# Altium schematic sheet pwr.SchDoc
size A3; SheetNumber: 4; SheetTotal: 6
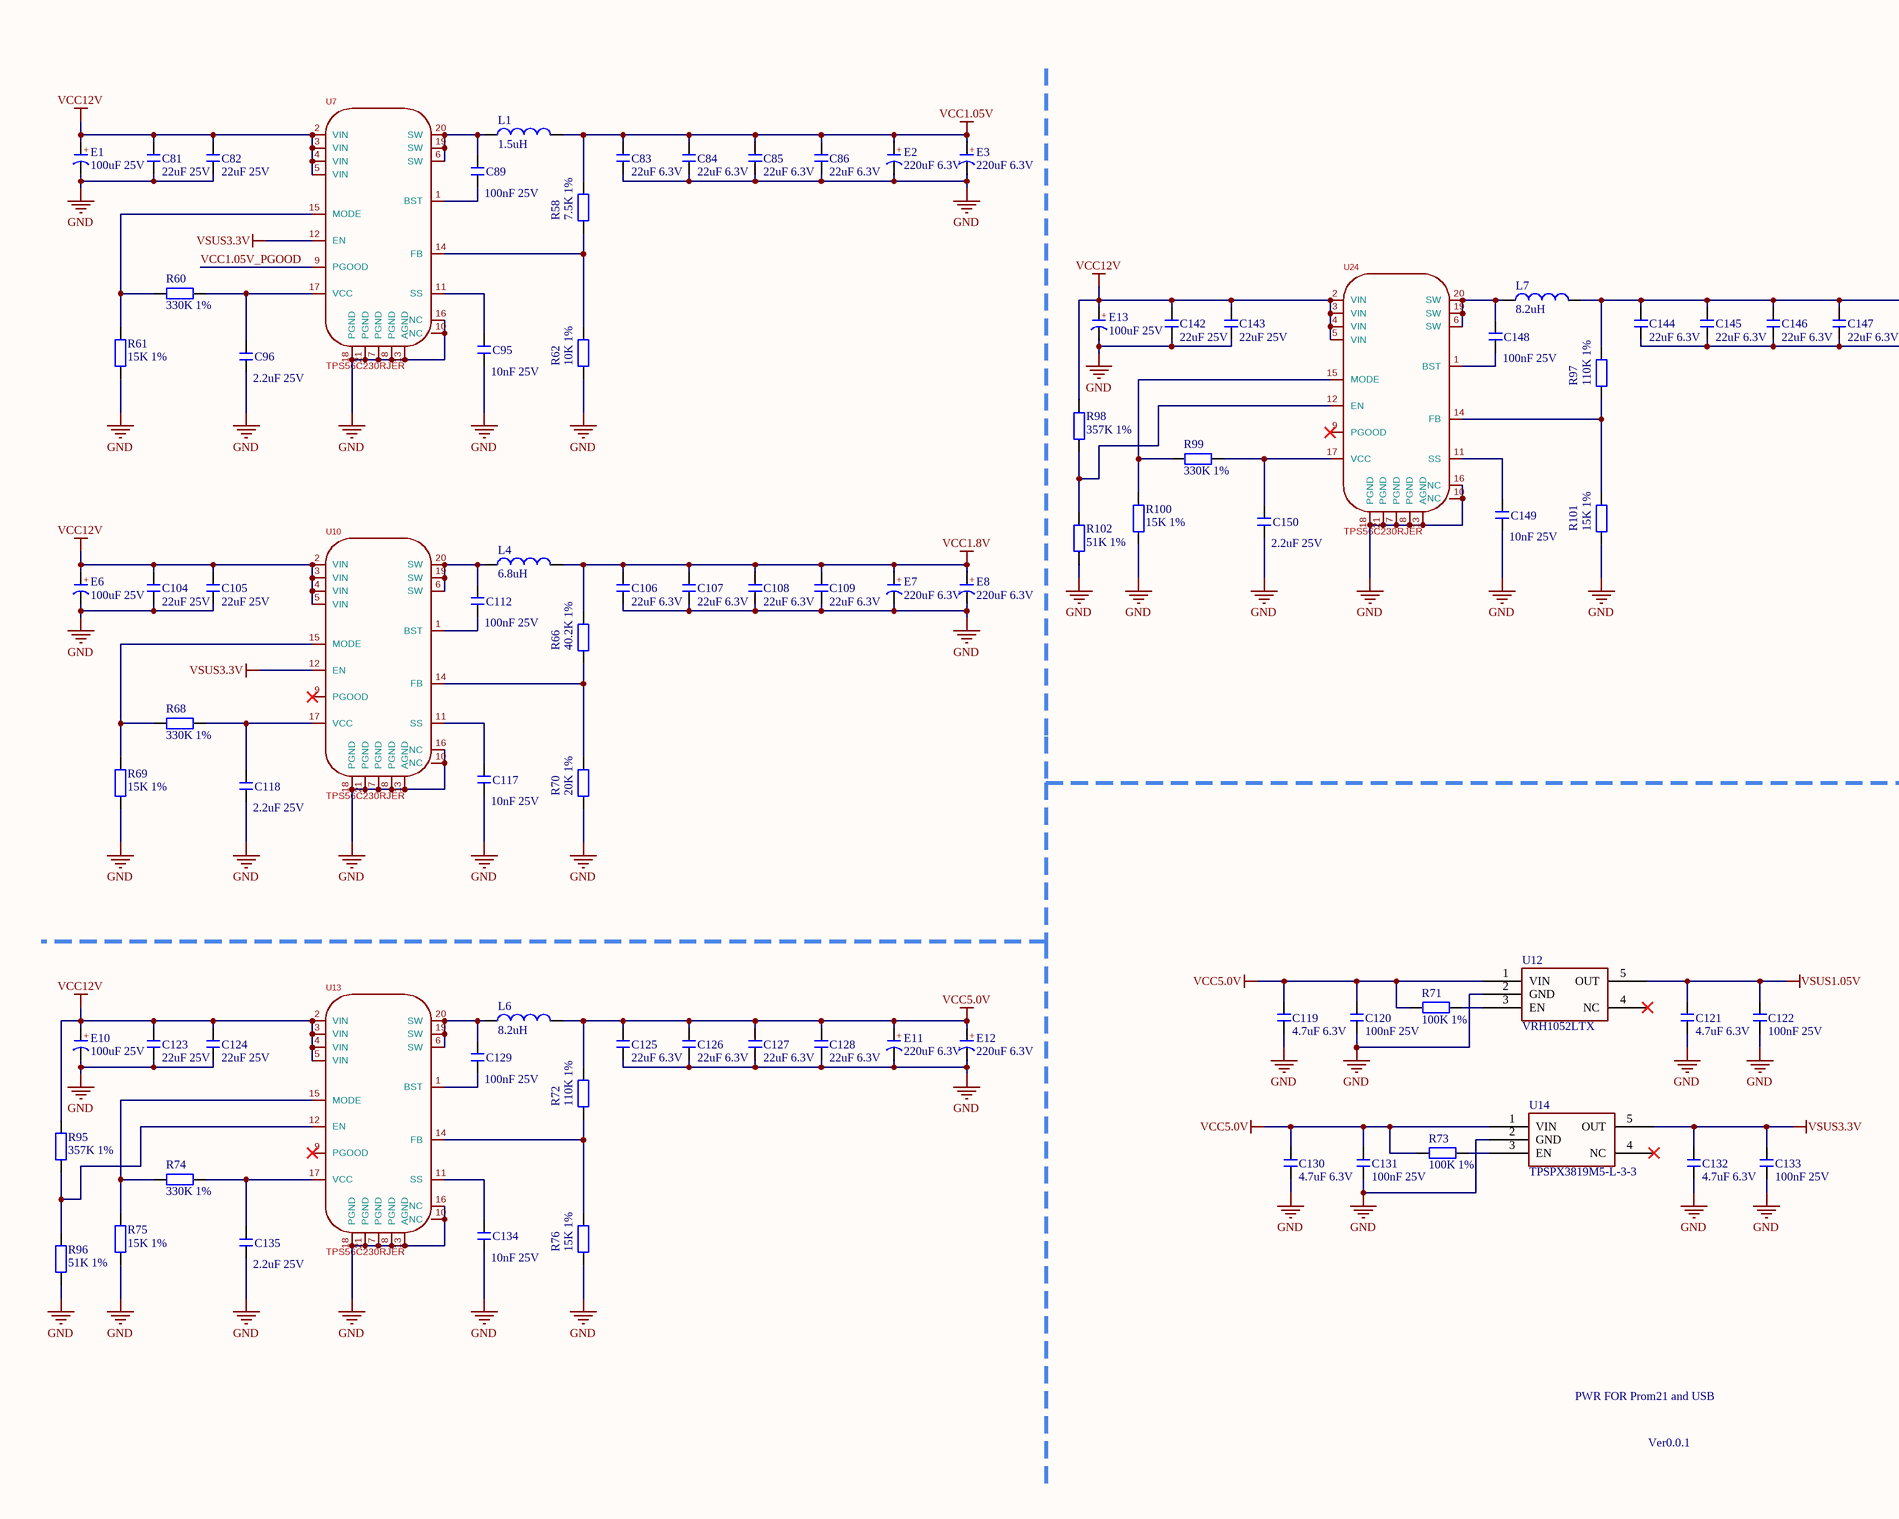
[diagram p0: pwr.SchDoc, left]
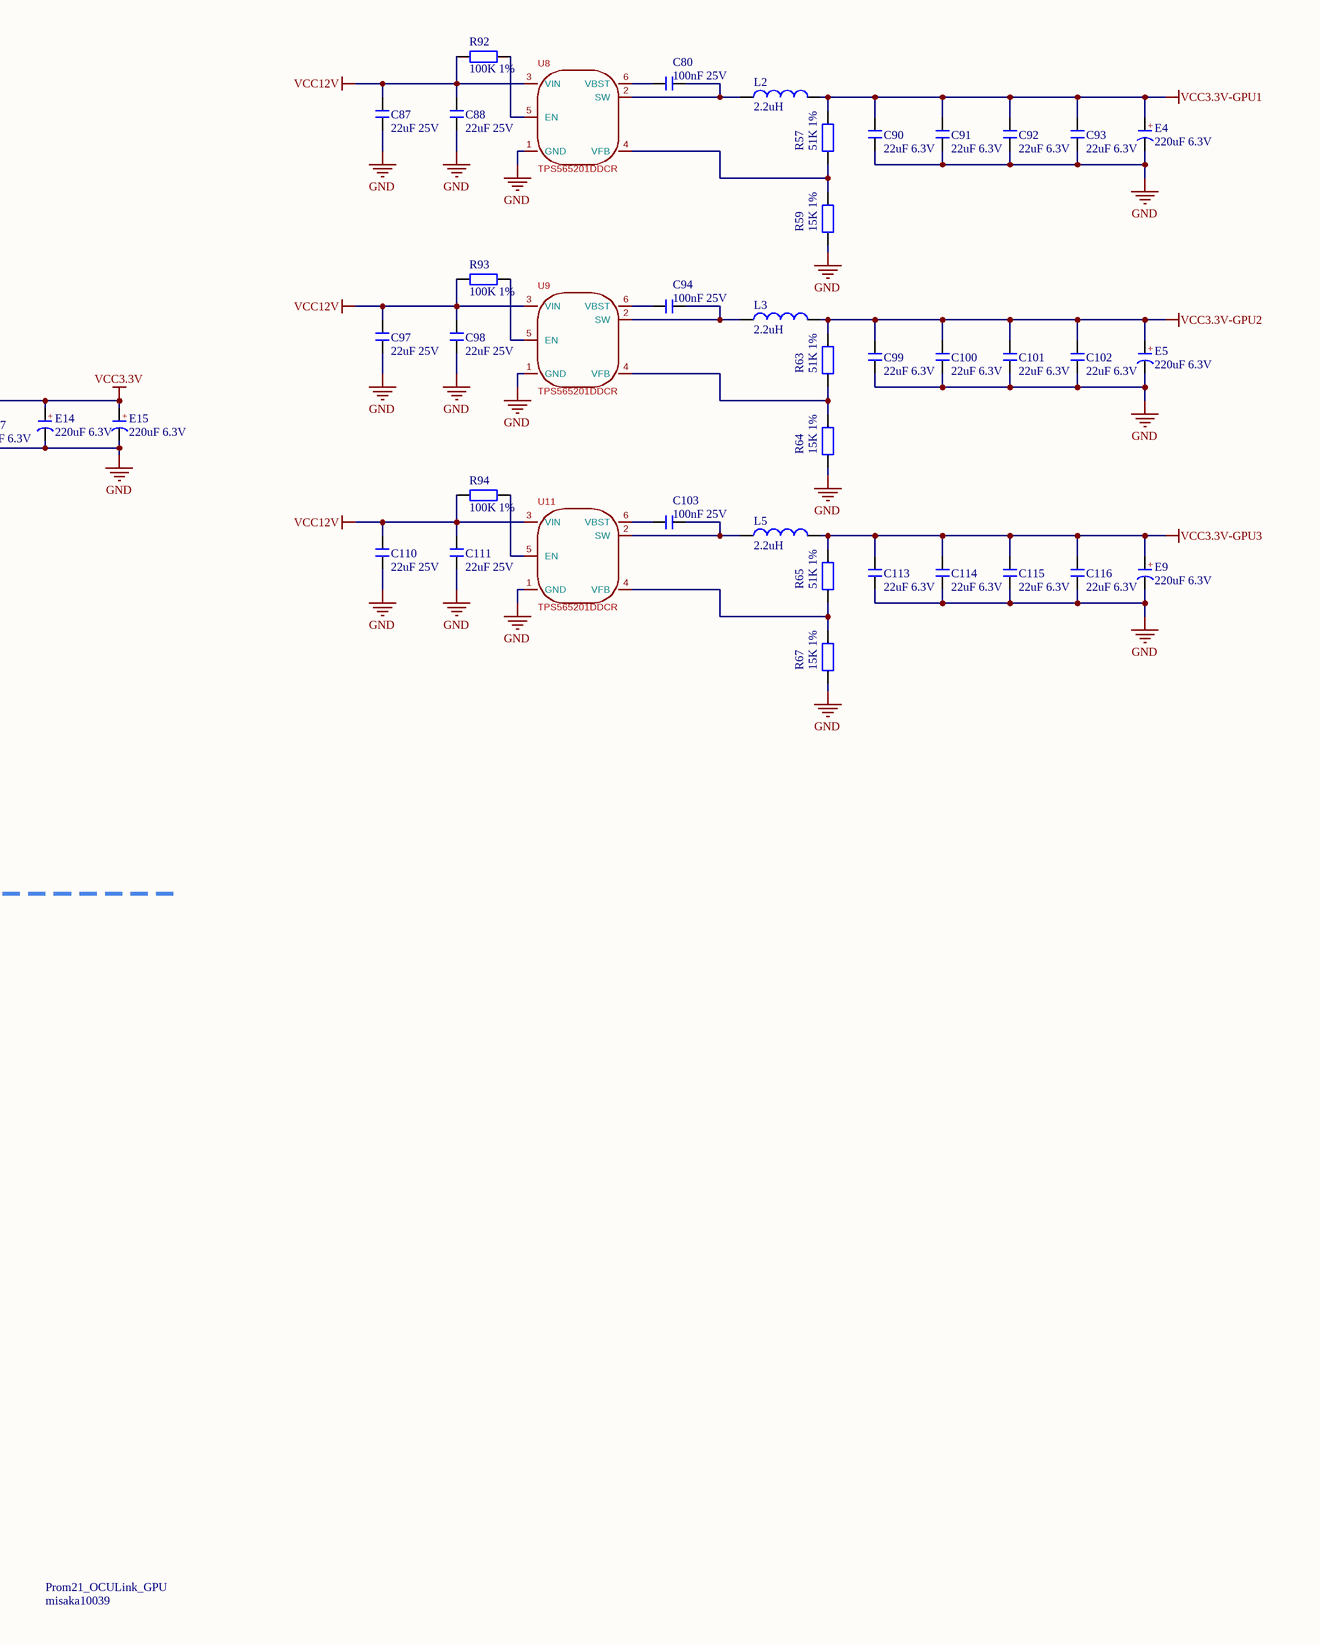
[diagram p1: pwr.SchDoc, right]

## Parts
C80  100nF 25V  [C0402_L]
C81  22uF 25V  [C0805_L]
C82  22uF 25V  [C0805_L]
C83  22uF 6.3V  [C0603_L]
C84  22uF 6.3V  [C0603_L]
C85  22uF 6.3V  [C0603_L]
C86  22uF 6.3V  [C0603_L]
C87  22uF 25V  [C0805_L]
C88  22uF 25V  [C0805_L]
C89  100nF 25V  [C0402_L]
C90  22uF 6.3V  [C0603_L]
C91  22uF 6.3V  [C0603_L]
C92  22uF 6.3V  [C0603_L]
C93  22uF 6.3V  [C0603_L]
C94  100nF 25V  [C0402_L]
C95  10nF 25V  [C0402_L]
C96  2.2uF 25V  [C0402_L]
C97  22uF 25V  [C0805_L]
C98  22uF 25V  [C0805_L]
C99  22uF 6.3V  [C0603_L]
C100  22uF 6.3V  [C0603_L]
C101  22uF 6.3V  [C0603_L]
C102  22uF 6.3V  [C0603_L]
C103  100nF 25V  [C0402_L]
C104  22uF 25V  [C0805_L]
C105  22uF 25V  [C0805_L]
C106  22uF 6.3V  [C0603_L]
C107  22uF 6.3V  [C0603_L]
C108  22uF 6.3V  [C0603_L]
C109  22uF 6.3V  [C0603_L]
C110  22uF 25V  [C0805_L]
C111  22uF 25V  [C0805_L]
C112  100nF 25V  [C0402_L]
C113  22uF 6.3V  [C0603_L]
C114  22uF 6.3V  [C0603_L]
C115  22uF 6.3V  [C0603_L]
C116  22uF 6.3V  [C0603_L]
C117  10nF 25V  [C0402_L]
C118  2.2uF 25V  [C0402_L]
C119  4.7uF 6.3V  [C0402_L]
C120  100nF 25V  [C0402_L]
C121  4.7uF 6.3V  [C0402_L]
C122  100nF 25V  [C0402_L]
C123  22uF 25V  [C0805_L]
C124  22uF 25V  [C0805_L]
C125  22uF 6.3V  [C0603_L]
C126  22uF 6.3V  [C0603_L]
C127  22uF 6.3V  [C0603_L]
C128  22uF 6.3V  [C0603_L]
C129  100nF 25V  [C0402_L]
C130  4.7uF 6.3V  [C0402_L]
C131  100nF 25V  [C0402_L]
C132  4.7uF 6.3V  [C0402_L]
C133  100nF 25V  [C0402_L]
C134  10nF 25V  [C0402_L]
C135  2.2uF 25V  [C0402_L]
C142  22uF 25V  [C0805_L]
C143  22uF 25V  [C0805_L]
C144  22uF 6.3V  [C0603_L]
C145  22uF 6.3V  [C0603_L]
C146  22uF 6.3V  [C0603_L]
C147  22uF 6.3V  [C0603_L]
C148  100nF 25V  [C0402_L]
C149  10nF 25V  [C0402_L]
C150  2.2uF 25V  [C0402_L]
E1  100uF 25V  [CT 6*4 - R]
E2  220uF 6.3V  [CT 6*4 - C]
E3  220uF 6.3V  [CT 6*4 - C]
E4  220uF 6.3V  [CT 6*4 - C]
E5  220uF 6.3V  [CT 6*4 - C]
E6  100uF 25V  [CT 6*4 - R]
E7  220uF 6.3V  [CT 6*4 - C]
E8  220uF 6.3V  [CT 6*4 - C]
E9  220uF 6.3V  [CT 6*4 - C]
E10  100uF 25V  [CT 6*4 - R]
E11  220uF 6.3V  [CT 6*4 - C]
E12  220uF 6.3V  [CT 6*4 - C]
E13  100uF 25V  [CT 6*4 - R]
E14  220uF 6.3V  [CT 6*4 - C]
E15  220uF 6.3V  [CT 6*4 - C]
L1  1.5uH  [L0630贴片电感]
L2  2.2uH  [L0630贴片电感]
L3  2.2uH  [L0630贴片电感]
L4  6.8uH  [L0630贴片电感]
L5  2.2uH  [L0630贴片电感]
L6  8.2uH  [L0630贴片电感]
L7  8.2uH  [L0630贴片电感]
R57  51K 1%  [R0402_L]
R58  7.5K 1%  [R0402_L]
R59  15K 1%  [R0402_L]
R60  330K 1%  [R0402_L]
R61  15K 1%  [R0402_L]
R62  10K 1%  [R0402_L]
R63  51K 1%  [R0402_L]
R64  15K 1%  [R0402_L]
R65  51K 1%  [R0402_L]
R66  40.2K 1%  [R0402_L]
R67  15K 1%  [R0402_L]
R68  330K 1%  [R0402_L]
R69  15K 1%  [R0402_L]
R70  20K 1%  [R0402_L]
R71  100K 1%  [R0402_L]
R72  110K 1%  [R0402_L]
R73  100K 1%  [R0402_L]
R74  330K 1%  [R0402_L]
R75  15K 1%  [R0402_L]
R76  15K 1%  [R0402_L]
R92  100K 1%  [R0402_L]
R93  100K 1%  [R0402_L]
R94  100K 1%  [R0402_L]
R95  357K 1%  [R0402_L]
R96  51K 1%  [R0402_L]
R97  110K 1%  [R0402_L]
R98  357K 1%  [R0402_L]
R99  330K 1%  [R0402_L]
R100  15K 1%  [R0402_L]
R101  15K 1%  [R0402_L]
R102  51K 1%  [R0402_L]
U7  TPS56C230RJER  [VQFN-20_L3.0-W3.0-P0.45-TL-EP_TI_RJE]
U8  TPS565201DDCR  [SOT23-6L]
U9  TPS565201DDCR  [SOT23-6L]
U10  TPS56C230RJER  [VQFN-20_L3.0-W3.0-P0.45-TL-EP_TI_RJE]
U11  TPS565201DDCR  [SOT23-6L]
U12  VRH1052LTX  [SOT23-5L]
U13  TPS56C230RJER  [VQFN-20_L3.0-W3.0-P0.45-TL-EP_TI_RJE]
U14  TPSPX3819M5-L-3-3  [SOT23-5L]
U24  TPS56C230RJER  [VQFN-20_L3.0-W3.0-P0.45-TL-EP_TI_RJE]

## Nets
GND: C81.1 C82.1 C83.1 C84.1 C85.1 C86.1 C87.1 C88.1 C90.1 C91.1 C92.1 C93.1 C95.1 C96.1 C97.1 C98.1 C99.1 C100.1 C101.1 C102.1 C104.1 C105.1 C106.1 C107.1 C108.1 C109.1 C110.1 C111.1 C113.1 C114.1 C115.1 C116.1 C117.1 C118.1 C119.1 C120.2 C121.1 C122.2 C123.1 C124.1 C125.1 C126.1 C127.1 C128.1 C130.1 C131.2 C132.1 C133.2 C134.1 C135.1 C142.1 C143.1 C144.1 C145.1 C146.1 C147.1 C149.1 C150.1 E1.2(K) E2.2(K) E3.2(K) E4.2(K) E5.2(K) E6.2(K) E7.2(K) E8.2(K) E9.2(K) E10.2(K) E11.2(K) E12.2(K) E13.2(K) E14.2(K) E15.2(K) R59.2 R61.1 R62.2 R64.2 R67.2 R69.1 R70.2 R75.1 R76.2 R96.1 R100.1 R101.2 R102.1 U7.7(PGND) U7.8(PGND) U7.10(NC) U7.13(AGND) U7.16(NC) U7.18(PGND) U7.21(PGND) U8.1(GND) U9.1(GND) U10.7(PGND) U10.8(PGND) U10.10(NC) U10.13(AGND) U10.16(NC) U10.18(PGND) U10.21(PGND) U11.1(GND) U12.2(GND) U13.7(PGND) U13.8(PGND) U13.10(NC) U13.13(AGND) U13.16(NC) U13.18(PGND) U13.21(PGND) U14.2(GND) U24.7(PGND) U24.8(PGND) U24.10(NC) U24.13(AGND) U24.16(NC) U24.18(PGND) U24.21(PGND)
VCC1.05V: C83.2 C84.2 C85.2 C86.2 E2.1(A) E3.1(A) L1.2 R58.1
VCC1.8V: C106.2 C107.2 C108.2 C109.2 E7.1(A) E8.1(A) L4.2 R66.1
VCC3.3V: C144.2 C145.2 C146.2 C147.2 E14.1(A) E15.1(A) L7.2 R97.1
VCC3.3V-GPU1: C90.2 C91.2 C92.2 C93.2 E4.1(A) L2.2 R57.1
VCC3.3V-GPU2: C99.2 C100.2 C101.2 C102.2 E5.1(A) L3.2 R63.1
VCC3.3V-GPU3: C113.2 C114.2 C115.2 C116.2 E9.1(A) L5.2 R65.1
VCC5.0V: C119.2 C120.1 C125.2 C126.2 C127.2 C128.2 C130.2 C131.1 E11.1(A) E12.1(A) L6.2 R71.2 R72.1 R73.2 U12.1(VIN) U14.1(VIN)
VCC12V: C81.2 C82.2 C87.2 C88.2 C97.2 C98.2 C104.2 C105.2 C110.2 C111.2 C123.2 C124.2 C142.2 C143.2 E1.1(A) E6.1(A) E10.1(A) E13.1(A) R92.1 R93.1 R94.1 R95.2 R98.2 U7.2(VIN) U7.3(VIN) U7.4(VIN) U7.5(VIN) U8.3(VIN) U9.3(VIN) U10.2(VIN) U10.3(VIN) U10.4(VIN) U10.5(VIN) U11.3(VIN) U13.2(VIN) U13.3(VIN) U13.4(VIN) U13.5(VIN) U24.2(VIN) U24.3(VIN) U24.4(VIN) U24.5(VIN)
VSUS1.05V: C121.2 C122.1 U12.5(OUT)
VSUS3.3V: C132.2 C133.1 U7.12(EN) U10.12(EN) U14.5(OUT)
VCC1.05V_PGOOD: U7.9(PGOOD)
NetC80_1: C80.1 L2.1 U8.2(SW)
NetC80_2: C80.2 U8.6(VBST)
NetC89_1: C89.1 U7.1(BST)
NetC89_2: C89.2 L1.1 U7.6(SW) U7.19(SW) U7.20(SW)
NetC94_1: C94.1 L3.1 U9.2(SW)
NetC94_2: C94.2 U9.6(VBST)
NetC95_2: C95.2 U7.11(SS)
NetC96_2: C96.2 R60.1 U7.17(VCC)
NetC103_1: C103.1 L5.1 U11.2(SW)
NetC103_2: C103.2 U11.6(VBST)
NetC112_1: C112.1 U10.1(BST)
NetC112_2: C112.2 L4.1 U10.6(SW) U10.19(SW) U10.20(SW)
NetC117_2: C117.2 U10.11(SS)
NetC118_2: C118.2 R68.1 U10.17(VCC)
NetC129_1: C129.1 U13.1(BST)
NetC129_2: C129.2 L6.1 U13.6(SW) U13.19(SW) U13.20(SW)
NetC134_2: C134.2 U13.11(SS)
NetC135_2: C135.2 R74.1 U13.17(VCC)
NetC148_1: C148.1 U24.1(BST)
NetC148_2: C148.2 L7.1 U24.6(SW) U24.19(SW) U24.20(SW)
NetC149_2: C149.2 U24.11(SS)
NetC150_2: C150.2 R99.1 U24.17(VCC)
NetR57_2: R57.2 R59.1 U8.4(VFB)
NetR58_2: R58.2 R62.1 U7.14(FB)
NetR60_2: R60.2 R61.2 U7.15(MODE)
NetR63_2: R63.2 R64.1 U9.4(VFB)
NetR65_2: R65.2 R67.1 U11.4(VFB)
NetR66_2: R66.2 R70.1 U10.14(FB)
NetR68_2: R68.2 R69.2 U10.15(MODE)
NetR71_1: R71.1 U12.3(EN)
NetR72_2: R72.2 R76.1 U13.14(FB)
NetR73_1: R73.1 U14.3(EN)
NetR74_2: R74.2 R75.2 U13.15(MODE)
NetR92_2: R92.2 U8.5(EN)
NetR93_2: R93.2 U9.5(EN)
NetR94_2: R94.2 U11.5(EN)
NetR95_1: R95.1 R96.2 U13.12(EN)
NetR97_2: R97.2 R101.1 U24.14(FB)
NetR98_1: R98.1 R102.2 U24.12(EN)
NetR99_2: R99.2 R100.2 U24.15(MODE)

Not connected (* = marked no-connect by the designer): U10 9(PGOOD)*; U12 4(NC)*; U13 9(PGOOD)*; U14 4(NC)*; U24 9(PGOOD)*

## Notes on the sheet
- PWR FOR Prom21 and USB
- Ver0.0.1
- Prom21_OCULink_GPU
- misaka10039
- (in symbol C-CAP) +

## Library data of the parts
C80-C135 C142-C150 = C: 无极性贴片电容; 版权归属: 源创客; 材质: X7R; BOM名称: 无极性贴片电容; 学习资源: www.ooocke.com
E1-E15 = C-CAP: 贴片电解电容; BOM名称: 直插电解电容; 版权归属: 源创客; 学习资源: www.ooocke.com
L1-L7 = L: 小功率贴片电感; 版权归属: 源创客; BOM名称: 小功率贴片电感; 学习资源: www.ooocke.com
R57-R76 R92-R102 = R: 贴片电阻; 版权归属: 源创客; BOM名称: 贴片电阻; 学习资源: www.ooocke.com
U7 U10 U13 U24 = TPS56C230RJER: 功能类型:降压型;输出类型:可调;输入电压:4.5V~18V;输出电压:600mV~5.5V;输出电流(最大值):12A;; Manufacturer: TI(德州仪器); AddInBom: yes; Function: 降压型; Output Type: 可调; Output Current (Max): 12A; Switching Frequency: 500kHz; Synchronous Rectification: 是; Number of Outputs: 1; Topology: 降压式; Switch tube (built-in/external): 内置; ModelId: a0d54152b84047e092cea8f9e273e78e; ModelTransform: 118.8974,118.8974,0,0,0,0,0,0,0; Symbol: TPS56C230RJER; Device: TPS56C230RJER; Supplier: LCSC; SupplierPart: C1849534; ManufacturerPart: TPS56C230RJER; JLCPCB Part Class: 扩展库; LCSC Part Name: TPS56C230RJER; Supplier Footprint: VQFN-20-EP(3x3); Datasheet: https://www.ti.com/cn/lit/gpn/tps56c230; ConvertToPcb: yes; Input Voltage: 4.5V~18V; Output Voltage: 600mV~5.5V; Operating Temperature: -40℃~+125℃@(TJ); FootprintName: VQFN-20_L3.0-W3.0-P0.45-TL-EP_TI_RJE; ModelName: VQFN-20_L3.0-W3.0-P0.45-TL-EP_TI_RJE
U8 U9 U11 = TPS565201DDCR: 功能类型:降压型;输出类型:可调;输入电压:4.5V~17V;输出电压:600mV~7V;输出电流(最大值):5A;; Manufacturer: TI(德州仪器); AddInBom: yes; Function: 降压型; Output Type: 可调; Output Current (Max): 5A; Switching Frequency: 500kHz; Synchronous Rectification: 是; Number of Outputs: 1; Topology: 降压式; Switch tube (built-in/external): 内置; ModelId: 2c4039b5b88644c1bda4b4ba9e971667; ModelName: TSOT-23-6_L2.9-W1.6-H1.1-LS2.8-P0.95; ModelTransform: 110.236,114.173,0,90,0,0,0,0,0; Device: TPS565201DDCR; LCSC Part Name: TPS565201DDCR; SupplierPart: C327676; ManufacturerPart: TPS565201DDCR; Supplier Footprint: TSOT-23-6; JLCPCB Part Class: 扩展库; Supplier: LCSC; ConvertToPcb: yes; Input Voltage: 4.5V~17V; Output Voltage: 600mV~7V; Operating Temperature: -40℃~+125℃@(TJ); SymbolName: TPS565201DDCR; FootprintName: TSOT-23-6_L2.9-W1.6-P0.95-LS2.8-BL
U12 U14 = LP5907_MFX: SOT-23-5